# Altium schematic sheet Motor.SchDoc: StepMotor Controller
size A4; Organization: NTUST EE-305; Address1: No.43, Sec. 4, Keelung Rd.; Address2: Da’an Dist.; Address3: Taipei 106; Address4: Taiwan (R.O.C.); DocumentNumber: 3; Revision: 1.0; SheetNumber: 3; SheetTotal: 8
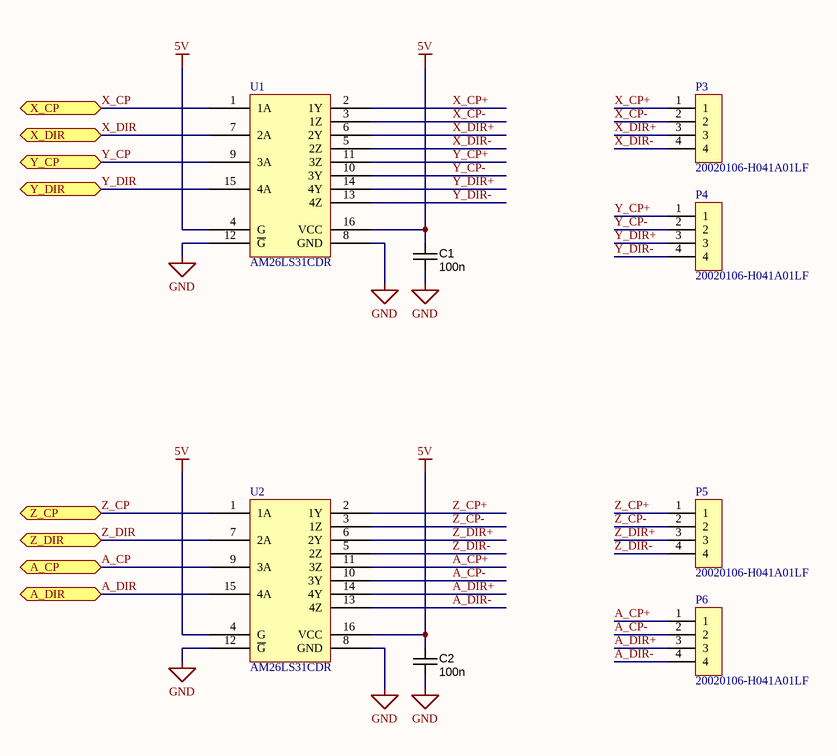
[diagram p0: Motor.SchDoc]

## Parts
C1  100n  [CAPC1608N]
C2  100n  [CAPC1608N]
P3  20020106-H041A01LF  [20020106-H041A01LF]
P4  20020106-H041A01LF  [20020106-H041A01LF]
P5  20020106-H041A01LF  [20020106-H041A01LF]
P6  20020106-H041A01LF  [20020106-H041A01LF]
U1  AM26LS31CDR  [SOIC16_N]
U2  AM26LS31CDR  [SOIC16_N]

## Ports
A_CP, A_DIR, X_CP, X_DIR, Y_CP, Y_DIR, Z_CP, Z_DIR

## Nets
5V: C1.1 C2.1 U1.4(G) U1.16(VCC) U2.4(G) U2.16(VCC)
GND: C1.2 C2.2 U1.8(GND) U1.12(~{G}) U2.8(GND) U2.12(~{G})
A_CP: U2.9(3A) ; port A_CP
A_CP+: P6.1 U2.11(3Z)
A_CP-: P6.2 U2.10(3Y)
A_DIR: U2.15(4A) ; port A_DIR
A_DIR+: P6.3 U2.14(4Y)
A_DIR-: P6.4 U2.13(4Z)
X_CP: U1.1(1A) ; port X_CP
X_CP+: P3.1 U1.2(1Y)
X_CP-: P3.2 U1.3(1Z)
X_DIR: U1.7(2A) ; port X_DIR
X_DIR+: P3.3 U1.6(2Y)
X_DIR-: P3.4 U1.5(2Z)
Y_CP: U1.9(3A) ; port Y_CP
Y_CP+: P4.1 U1.11(3Z)
Y_CP-: P4.2 U1.10(3Y)
Y_DIR: U1.15(4A) ; port Y_DIR
Y_DIR+: P4.3 U1.14(4Y)
Y_DIR-: P4.4 U1.13(4Z)
Z_CP: U2.1(1A) ; port Z_CP
Z_CP+: P5.1 U2.2(1Y)
Z_CP-: P5.2 U2.3(1Z)
Z_DIR: U2.7(2A) ; port Z_DIR
Z_DIR+: P5.3 U2.6(2Y)
Z_DIR-: P5.4 U2.5(2Z)

## Notes on the sheet
- Title
- Name
- Size:
- Revision:
- A4
- Date:
- Time:
- Sheet
- of

## Library data of the parts
C1 C2 = Capacitor SMD Cer X7R: Manufacturer 1: Kemet; Manufacturer Part Number 1: C0805C104K5RACTU; Tolerance: ?0%; Ratings: 50V; X7R; Material: ceramic; Package / Case: 0805 (2012 metric); Supplier 1: Digi-Key; Supplier Part Number 1: 399-1170-1-ND; Value: 100n
P3-P6 = Amphenol FCI: TERM BLOCK HDR 4POS VERT 5.08MM
U1 U2 = AM26LS31C: IC QUAD DIFF LINE DRIVER 16-SOIC